# Altium schematic sheet TopLevel.SchDoc: Top Level Hierarchy
size 279 x 215 mm; DrawnBy: Connor Dack; DocumentNumber: 4; Revision: 1.0; SheetNumber: 4; SheetTotal: 11
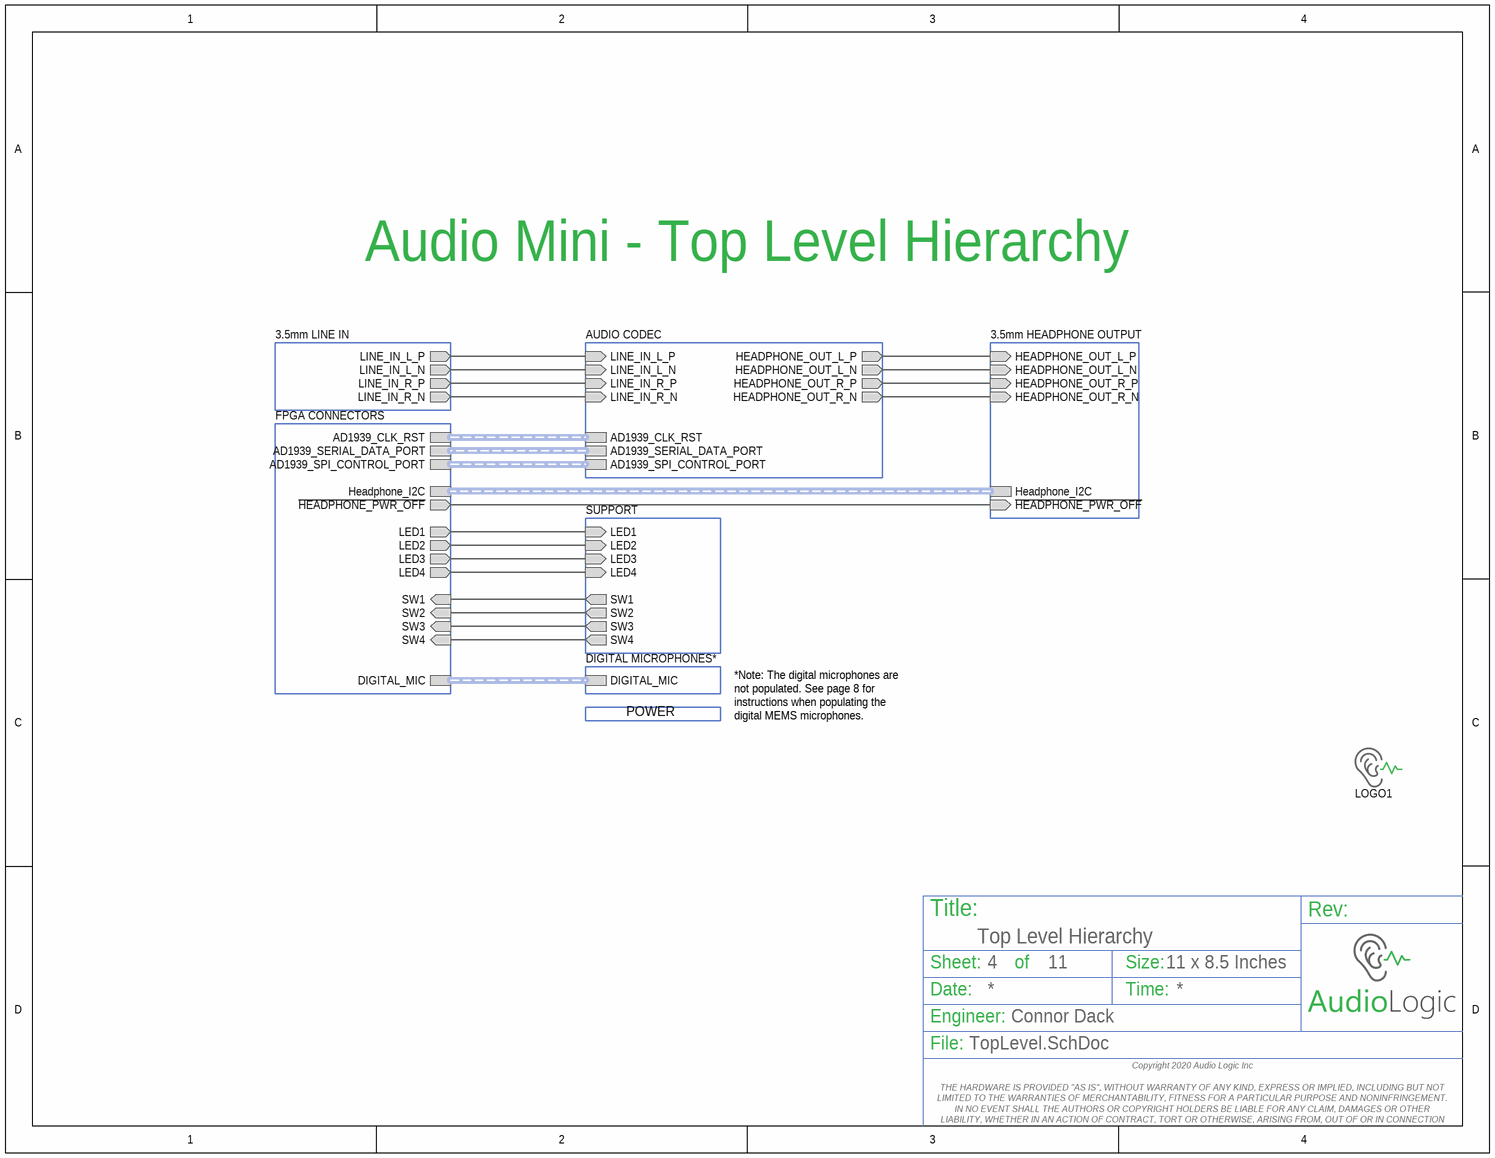
[diagram p0: TopLevel.SchDoc]

## Parts
LOGO1  Audio Logic Logo  [AL_Logo_Small_Silkscreen]  (value not drawn)  (no BOM)

## Sub-sheets
3.5mm HEADPHONE OUTPUT = Audio_Output_Headphone.SchDoc: HEADPHONE_OUT_R_N (in), HEADPHONE_OUT_R_P (in), HEADPHONE_OUT_L_N (in), HEADPHONE_OUT_L_P (in), ~{HEADPHONE_PWR_OFF} (in), Headphone_I2C (harness I2C_Headphone)
3.5mm LINE IN = Audio_Input_Line_In.SchDoc: LINE_IN_R_P (out), LINE_IN_R_N (out), LINE_IN_L_P (out), LINE_IN_L_N (out)
AUDIO CODEC = Audio_Codec.SchDoc: HEADPHONE_OUT_R_N (out), HEADPHONE_OUT_R_P (out), HEADPHONE_OUT_L_N (out), HEADPHONE_OUT_L_P (out), LINE_IN_R_P (in), LINE_IN_R_N (in), LINE_IN_L_P (in), LINE_IN_L_N (in), AD1939_CLK_RST (harness AD1939_CLK_RST), AD1939_SERIAL_DATA_PORT (harness AD19319_Serial_Data_Port), AD1939_SPI_CONTROL_PORT (harness SPI_Audio_Codec)
DIGITAL MICROPHONES* = Audio_Input_Digitial_Mic.SchDoc: DIGITAL_MIC (harness Digital_Mic)
FPGA CONNECTORS = FPGA_Connectors.SchDoc: SW1 (in), SW3 (in), SW2 (in), SW4 (in), LED1 (out), LED2 (out), LED3 (out), LED4 (out), DIGITAL_MIC (harness Digital_Mic), Headphone_I2C (harness I2C_Headphone), ~{HEADPHONE_PWR_OFF} (out), AD1939_SPI_CONTROL_PORT (harness SPI_Audio_Codec), AD1939_SERIAL_DATA_PORT (harness AD19319_Serial_Data_Port), AD1939_CLK_RST (harness AD1939_CLK_RST)
POWER = Power.SchDoc: no entries
SUPPORT = Support.SchDoc: SW1 (out), SW2 (out), SW3 (out), SW4 (out), LED1 (in), LED2 (in), LED3 (in), LED4 (in)

## Nets
(unnamed): sheet 3.5mm HEADPHONE OUTPUT/HEADPHONE_OUT_R_N, sheet AUDIO CODEC/HEADPHONE_OUT_R_N
(unnamed): sheet 3.5mm HEADPHONE OUTPUT/HEADPHONE_OUT_R_P, sheet AUDIO CODEC/HEADPHONE_OUT_R_P
(unnamed): sheet 3.5mm HEADPHONE OUTPUT/HEADPHONE_OUT_L_N, sheet AUDIO CODEC/HEADPHONE_OUT_L_N
(unnamed): sheet 3.5mm HEADPHONE OUTPUT/HEADPHONE_OUT_L_P, sheet AUDIO CODEC/HEADPHONE_OUT_L_P
(unnamed): sheet 3.5mm HEADPHONE OUTPUT/~{HEADPHONE_PWR_OFF}, sheet FPGA CONNECTORS/~{HEADPHONE_PWR_OFF}
(unnamed): sheet SUPPORT/SW1, sheet FPGA CONNECTORS/SW1
(unnamed): sheet SUPPORT/SW2, sheet FPGA CONNECTORS/SW2
(unnamed): sheet SUPPORT/SW3, sheet FPGA CONNECTORS/SW3
(unnamed): sheet SUPPORT/SW4, sheet FPGA CONNECTORS/SW4
(unnamed): sheet SUPPORT/LED1, sheet FPGA CONNECTORS/LED1
(unnamed): sheet SUPPORT/LED2, sheet FPGA CONNECTORS/LED2
(unnamed): sheet SUPPORT/LED3, sheet FPGA CONNECTORS/LED3
(unnamed): sheet SUPPORT/LED4, sheet FPGA CONNECTORS/LED4
(unnamed): sheet 3.5mm LINE IN/LINE_IN_R_P, sheet AUDIO CODEC/LINE_IN_R_P
(unnamed): sheet 3.5mm LINE IN/LINE_IN_R_N, sheet AUDIO CODEC/LINE_IN_R_N
(unnamed): sheet 3.5mm LINE IN/LINE_IN_L_P, sheet AUDIO CODEC/LINE_IN_L_P
(unnamed): sheet 3.5mm LINE IN/LINE_IN_L_N, sheet AUDIO CODEC/LINE_IN_L_N

## Buses and harness runs
harness sheet 3.5mm HEADPHONE OUTPUT/Headphone_I2C = sheet FPGA CONNECTORS/Headphone_I2C
harness sheet AUDIO CODEC/AD1939_CLK_RST = sheet FPGA CONNECTORS/AD1939_CLK_RST
harness sheet AUDIO CODEC/AD1939_SERIAL_DATA_PORT = sheet FPGA CONNECTORS/AD1939_SERIAL_DATA_PORT
harness sheet AUDIO CODEC/AD1939_SPI_CONTROL_PORT = sheet FPGA CONNECTORS/AD1939_SPI_CONTROL_PORT
harness sheet DIGITAL MICROPHONES*/DIGITAL_MIC = sheet FPGA CONNECTORS/DIGITAL_MIC

## Notes on the sheet
- Audio Mini - Top Level Hierarchy
- *Note: The digital microphones are not populated. See page 8 for instructions when populating the digital MEMS microphones.
- Title:
- Sheet:
- of
- Size:
- 11 x 8.5 Inches
- Rev:
- Date:
- Engineer:
- Time:
- File:
- Copyright 2020 Audio Logic Inc
  THE HARDWARE IS PROVIDED "AS IS", WITHOUT WARRANTY OF ANY KIND, EXPRESS OR IMPLIED, INCLUDING BUT NOT LIMITED TO THE WARRANTIES OF MERCHANTABILITY, FITNESS FOR A PARTICULAR PURPOSE AND NONINFRINGEMENT. IN NO EVENT SHALL THE AUTHORS OR COPYRIGHT HOLDERS BE LIABLE FOR ANY CLAIM, DAMAGES OR OTHER LIABILITY, WHETHER IN AN ACTION OF CONTRACT, TORT OR OTHERWISE, ARISING FROM, OUT OF OR IN CONNECTION WITH THE HARDWARE OR THE USE OR OTHER DEALINGS IN THE HARDWARE.

## Library data of the parts
LOGO1 = Audio_Logic_Logo